# Altium project mimosa_host_fsr.PrjPcb
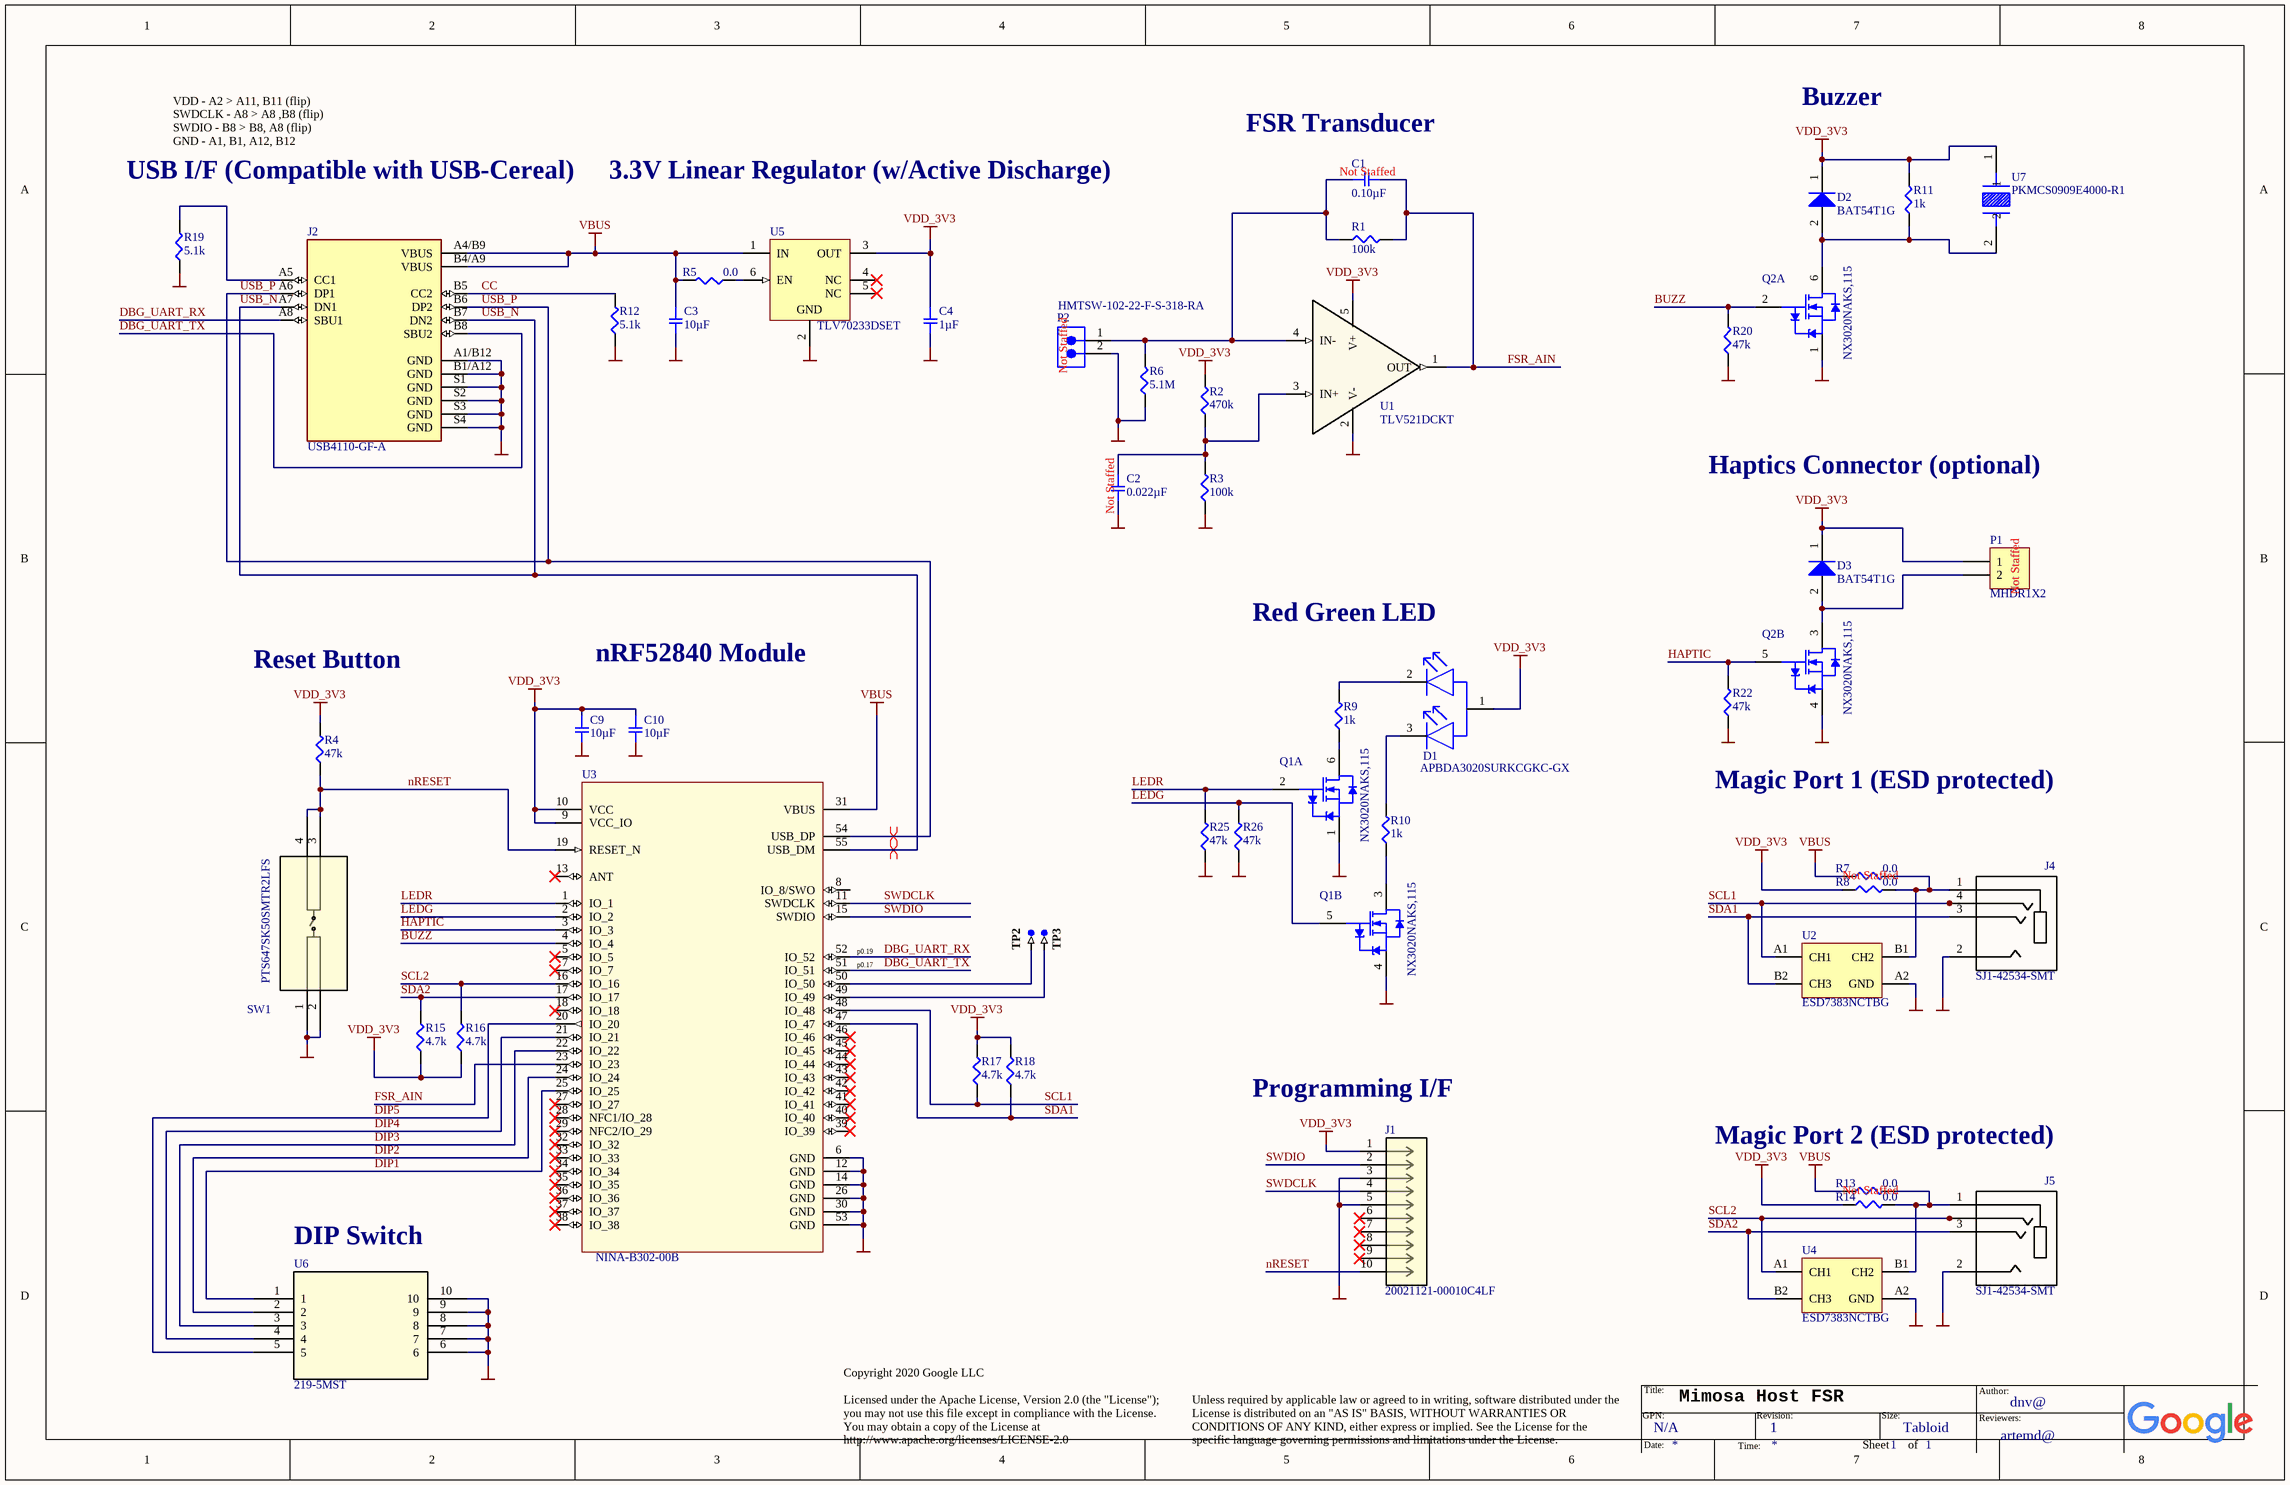
[diagram p0: mimosa_host_fsr_sch.SchDoc]
1 sheet, 50 parts. Net scope: global (net labels, ports and power ports of the same name join across sheets).
Board file: mimosa_host_fsr.PcbDoc

## Sheet mimosa_host_fsr_sch.SchDoc: Mimosa Host FSR
size Tabloid; CheckedBy: artemd@; Author: dnv@; DrawnBy: dnv; Organization: Altium Limited; Address1: 1600 Amphitheatre Pkwy, Mountain View CA 94043; DocumentNumber: N/A; Revision: 1; SheetNumber: 1; SheetTotal: 1

### Parts
C1  0.10µF  [SMD-0201C]
C2  0.022µF  [SMD-0201C]
C3  10µF  [SMD-0402C]
C4  1µF  [SMD-0201C]
C9  10µF  [SMD-0402C]
C10  10µF  [SMD-0402C]
D1  APBDA3020SURKCGKC-GX  [Kingbright_0_MFG]
D2  BAT54T1G  [ONSC-SOD-123-2-425-04_V]
D3  BAT54T1G  [ONSC-SOD-123-2-425-04_V]
J1  20021121-00010C4LF  [CONN_00010C4LF_A]
J2  USB4110-GF-A  [GCT_USB4110-GF-A]
J4  SJ1-42534-SMT  [*CUI_SJ1-42534-SMT_SJ1-42534-SMT(Primary)]
J5  SJ1-42534-SMT  [*CUI_SJ1-42534-SMT_SJ1-42534-SMT(Primary)]
P1  MHDR1X2  [MHDR1X2]
P2  HMTSW-102-22-F-S-318-RA  [SMTC-HMTSW-102-22-X-S-318-RA]
Q1  NX3020NAKS,115  [NXP-SOT363_N]  (parts A,B of 2)
Q2  NX3020NAKS,115  [NXP-SOT363_N]  (parts A,B of 2)
R1  100k  [SMD-0201-RES]
R2  470k  [SMD-0201-RES]
R3  100k  [SMD-0201-RES]
R4  47k  [SMD-0201-RES]
R5  0.0  [SMD-0201-RES]
R6  5.1M  [SMD-0201-RES]
R7  0.0  [SMD-0201-RES]
R8  0.0  [SMD-0201-RES]
R9  1k  [SMD-0201-RES]
R10  1k  [SMD-0201-RES]
R11  1k  [SMD-0201-RES]
R12  5.1k  [SMD-0201-RES]
R13  0.0  [SMD-0201-RES]
R14  0.0  [SMD-0201-RES]
R15  4.7k  [SMD-0201-RES]
R16  4.7k  [SMD-0201-RES]
R17  4.7k  [SMD-0201-RES]
R18  4.7k  [SMD-0201-RES]
R19  5.1k  [SMD-0201-RES]
R20  47k  [SMD-0201-RES]
R22  47k  [SMD-0201-RES]
R25  47k  [SMD-0201-RES]
R26  47k  [SMD-0201-RES]
SW1  PTS647SK50SMTR2LFS  [PTS647SK50SMTR2L]
TP2  TP-SM-C-100  [TP-SM-C-100]  (value not drawn)  (no BOM)
TP3  TP-SM-C-100  [TP-SM-C-100]  (value not drawn)  (no BOM)
U1  TLV521DCKT  [*SOT65P210X110-5N]
U2  ESD7383NCTBG  [ONSC-WLCSP-4-567CB-01]
U3  NINA-B302-00B  [NINA-B302-00B]
U4  ESD7383NCTBG  [ONSC-WLCSP-4-567CB-01]
U5  TLV70233DSET  [TI-DSE6_V]
U6  219-5MST  [SW5_219SMT]
U7  PKMCS0909E4000-R1  [XDCR_PKMCS0909E4000-R1]

### Nets
GND: C2.2 C3.2 C4.2 C9.2 C10.2 J1.3 J1.5 J2.A1/B12(GND) J2.B1/A12(GND) J2.S1(GND) J2.S2(GND) J2.S3(GND) J2.S4(GND) J4.2 J5.2 P2.2 Q1.1(S1) Q1.4(S2) Q2.1(S1) Q2.4(S2) R3.1 R6.1 R12.1 R19.1 R20.1 R22.1 R25.1 R26.1 SW1.1 SW1.2 U1.2(V-) U2.A2(GND) U3.6(GND) U3.12(GND) U3.14(GND) U3.26(GND) U3.30(GND) U3.53(GND) U4.A2(GND) U5.2(GND) U6.6 U6.7 U6.8 U6.9 U6.10
VBUS: C3.1 J2.A4/B9(VBUS) J2.B4/A9(VBUS) R5.2 R7.1 R13.1 U3.31(VBUS) U5.1(IN)
VDD_3V3: C4.1 C9.1 C10.1 D1.1(Common_Anode) D2.1(K) D3.1(K) J1.1 P1.1 R2.2 R4.2 R8.1 R11.2 R14.1 R15.1 R16.1 R17.2 R18.2 U1.5(V+) U3.9(VCC_IO) U3.10(VCC) U5.3(OUT) U7.1
BUZZ: Q2.2(G1) R20.2 U3.4(IO_4)
CC: J2.B5(CC2) R12.2
DBG_UART_RX: J2.A8(SBU1) U3.52(IO_52)
DBG_UART_TX: J2.B8(SBU2) U3.51(IO_51)
DIP1: U3.25(IO_25) U6.1
DIP2: U3.24(IO_24) U6.2
DIP3: U3.22(IO_22) U6.3
DIP4: U3.21(IO_21) U6.4
DIP5: U3.20(IO_20) U6.5
FSR_AIN: C1.2 R1.2 U1.1(OUT) U3.23(IO_23)
HAPTIC: Q2.5(G2) R22.2 U3.3(IO_3)
LEDG: Q1.5(G2) R26.2 U3.2(IO_2)
LEDR: Q1.2(G1) R25.2 U3.1(IO_1)
nRESET: J1.10 R4.1 SW1.3 SW1.4 U3.19(RESET_N)
SCL1: J4.4 J4.4.1 R17.1 U2.A1(CH1) U3.48(IO_48)
SCL2: J5.4 J5.4.1 R16.2 U3.16(IO_16) U4.A1(CH1)
SDA1: J4.3 R18.1 U2.B2(CH3) U3.47(IO_47)
SDA2: J5.3 R15.2 U3.17(IO_17) U4.B2(CH3)
SWDCLK: J1.4 U3.11(SWDCLK)
SWDIO: J1.2 U3.15(SWDIO)
USB_N: J2.A7(DN1) J2.B7(DN2) U3.55(USB_DM)
USB_P: J2.A6(DP1) J2.B6(DP2) U3.54(USB_DP)
NetC1_1: C1.1 P2.1 R1.1 R6.2 U1.4(IN-)
NetC2_1: C2.1 R2.1 R3.2 U1.3(IN+)
NetD1_2: D1.2(Red_C) R9.2
NetD1_3: D1.3(Green_C) R10.2
NetD2_2: D2.2(A) Q2.6(D1) R11.1 U7.2
NetD3_2: D3.2(A) P1.2 Q2.3(D2)
NetJ2_A5: J2.A5(CC1) R19.2
NetJ4_1: J4.1 R7.2 R8.2 U2.B1(CH2)
NetJ5_1: J5.1 R13.2 R14.2 U4.B1(CH2)
NetQ1_3: Q1.3(D2) R10.1
NetQ1_6: Q1.6(D1) R9.1
NetR5_1: R5.1 U5.6(EN)
NetTP2_1: TP2.1 U3.50(IO_50)
NetTP3_1: TP3.1 U3.49(IO_49)

Not connected (* = marked no-connect by the designer): J1 6* 7* 8* 9*; U3 5(IO_5)* 7(IO_7)* 8(IO_8/SWO) 13(ANT)* 18(IO_18)* 27(IO_27)* 28(NFC1/IO_28)* 29(NFC2/IO_29)* 32(IO_32)* 33(IO_33)* 34(IO_34)* 35(IO_35)* 36(IO_36)* 37(IO_37)* 38(IO_38)* 39(IO_39)* 40(IO_40)* 41(IO_41)* 42(IO_42)* 43(IO_43)* 44(IO_44)* 45(IO_45)* 46(IO_46)*; U5 4(NC)* 5(NC)*

### Layout directives
differential pair: USB_N, USB_P

### Notes on the sheet
- VDD - A2 > A11, B11 (flip)
  SWDCLK - A8 > A8 ,B8 (flip)
  SWDIO - B8 > B8, A8 (flip)
  GND - A1, B1, A12, B12
- (near C1) FSR Transducer
- Buzzer
- USB I/F (Compatible with USB-Cereal)
- 3.3V Linear Regulator (w/Active Discharge)
- (near C1) Not Staffed
- (near P2) Not Staffed
- Haptics Connector (optional)
- (near C2) Not Staffed
- Red Green LED
- (near P1) Not Staffed
- Reset Button
- nRF52840 Module
- Magic Port 1 (ESD protected)
- (near R7) Not Staffed
- (near U3) p0.19
- (near U3) p0.17
- (near J1) Programming I/F
- Magic Port 2 (ESD protected)
- (near R13) Not Staffed
- (near U6) DIP Switch
- Copyright 2020 Google LLC
  Licensed under the Apache License, Version 2.0 (the "License");
  you may not use this file except in compliance with the License.
  You may obtain a copy of the License at
  http://www.apache.org/licenses/LICENSE-2.0
- Unless required by applicable law or agreed to in writing, software distributed under the License is distributed on an "AS IS" BASIS, WITHOUT WARRANTIES OR CONDITIONS OF ANY KIND, either express or implied. See the License for the specific language governing permissions and limitations under the License.
- GPN:
- Title:
- Revision:
- Size:
- Tabloid
- Author:
- Reviewers:
- Date:
- Time:
- Sheet
- of

### Library data of the parts
C1 = GRT033C81A104KE01D: CAP CER 0.1UF 10V X6S 0201; Manufacturer: Murata Electronics North America; Factory Stock: 0; Unit Price (USD): 0.1; Minimum Quantity: 1; Tolerance: ±10%; Datasheets: http://search.murata.co.jp/Ceramy/image/img/A01X/G101/ENG/GRT033C81A104KE01-01.pdf; Image: //media.digikey.com/Renders/Murata%20Renders/GRT%20Series%200201%20(0603%20Metric).jpg; Digi-Key Part Number: 490-12232-1-ND; Part Number: GRT033C81A104KE01D; Quantity Available: 1647; @ qty: 0; Packaging: Cut Tape (CT); Series: GRT; Part Status: Active; Value: 0.10µF; Voltage: 10V; Temperature Coefficient: X6S; Operating Temperature: -55°C ~ 105°C; Features: -; Ratings: AEC-Q200; Applications: Automotive; Failure Rate: Surface Mount, MLCC; Mounting Type: 0201 (0603 Metric); Package / Case: 0.024" L x 0.012" W (0.60mm x 0.30mm); Size / Dimension: -; Height - Seated (Max): 0.013" (0.33mm); Thickness (Max): -; Lead Spacing: -
C2 = GRM033C80J223KE01D: CAP CER 0.022UF 6.3V X6S 0201; Manufacturer: Murata Electronics North America; Factory Stock: 0; Unit Price (USD): 0.1; Minimum Quantity: 1; Tolerance: ±10%; Datasheets: http://www.murata.com/~/media/webrenewal/support/library/catalog/products/capacitor/mlcc/c02e.pdf; Image: //media.digikey.com/Renders/Murata%20Renders/ZRB-SERIES-0402.jpg; Digi-Key Part Number: 490-8154-1-ND; Part Number: GRM033C80J223KE01D; Quantity Available: 18738; @ qty: 0; Packaging: Cut Tape (CT); Series: GRM; Part Status: Active; Value: 0.022µF; Voltage: 6.3V; Temperature Coefficient: X6S; Operating Temperature: -55°C ~ 105°C; Features: -; Ratings: -; Applications: General Purpose; Failure Rate: Surface Mount, MLCC; Mounting Type: 0201 (0603 Metric); Package / Case: 0.024" L x 0.012" W (0.60mm x 0.30mm); Size / Dimension: -; Height - Seated (Max): 0.013" (0.33mm); Thickness (Max): -; Lead Spacing: -
C3 C9 C10 = GRJ155R60J106ME11D: CAP CER 10UF 6.3V X5R 0402; Manufacturer: Murata Electronics North America; Factory Stock: 0; Unit Price (USD): 0.23; Minimum Quantity: 1; Tolerance: ±20%; Datasheets: http://psearch.en.murata.com/capacitor/product/GRJ155R60J106ME11%23.pdf; Image: //media.digikey.com/Renders/Murata%20Renders/ZRB-SERIES-0402.jpg; Digi-Key Part Number: 490-13211-1-ND; Quantity Available: 64064; @ qty: 0; Packaging: Cut Tape (CT); Series: GRJ; Part Status: Active; Value: 10µF; Voltage: 6.3V; Temperature Coefficient: X5R; Operating Temperature: -55°C ~ 85°C; Features: Derating Recommended, Soft Termination; Ratings: -; Applications: Boardflex Sensitive; Mounting Type: Surface Mount, MLCC; Package / Case: 0402 (1005 Metric); Size / Dimension: 0.039" L x 0.020" W (1.00mm x 0.50mm); Height - Seated (Max): -; Thickness (Max): 0.028" (0.70mm); Lead Spacing: -; Lead Style: -
  C3: MPN: GRJ155R60J106ME11D
  C9 C10: Part Number: GRJ155R60J106ME11D
C4 = GRM033R60J105MEA2D: CAP CER 1UF 6.3V X5R 0201; Manufacturer: Murata Electronics North America; Factory Stock: 0; Unit Price (USD): 0.12; Minimum Quantity: 1; Tolerance: ±20%; Datasheets: http://www.murata.com/~/media/webrenewal/support/library/catalog/products/capacitor/mlcc/c02e.pdf; Image: //media.digikey.com/Renders/Murata%20Renders/ZRB-SERIES-0402.jpg; Digi-Key Part Number: 490-7229-1-ND; Part Number: GRM033R60J105MEA2D; Quantity Available: 223818; @ qty: 0; Packaging: Cut Tape (CT); Series: GRM; Part Status: Active; Value: 1µF; Voltage: 6.3V; Temperature Coefficient: X5R; Operating Temperature: -55°C ~ 85°C; Features: Derating Recommended; Ratings: -; Applications: General Purpose; Failure Rate: Surface Mount, MLCC; Mounting Type: 0201 (0603 Metric); Package / Case: 0.024" L x 0.012" W (0.60mm x 0.30mm); Size / Dimension: -; Height - Seated (Max): 0.013" (0.33mm); Thickness (Max): -; Lead Spacing: -
D2 D3 = BAT54T1G: Schottky Barrier Diode, 2-Pin SOD-123, Pb-Free, Tape and Reel; Manufacturer: On Semiconductor; Configuration: Single; IFSM Max (A): 0.6; trr Max (ns): 5; DatasheetVersion: Rev. 9; PackageVersion: Rev. G, 10/2009; PackageReference: SOD-123-2-425-04; PackageDescription: 2-Pin SOD, Body 1.6 x 2.69 mm; Supplier 1: Digi-Key; Supplier Part Number 1: BAT54T1GOSTR-ND; Supplier 2: Digi-Key; Supplier Part Number 2: BAT54T1GOSCT-ND; Supplier 3: Digi-Key; Supplier Part Number 3: BAT54T1GOSDKR-ND; Supplier 4: Farnell; Supplier Part Number 4: 1651157RL; Supplier 5: Farnell; Supplier Part Number 5: 1651157; Supplier 6: Farnell; Supplier Part Number 6: 2364774; Supplier 7: Newark; Supplier Part Number 7: 67R1284; Supplier 8: Newark; Supplier Part Number 8: 88H4554; Supplier 9: Mouser; Supplier Part Number 9: 863-BAT54T1G; Packing: Tape and Reel; RoHS: TRUE; Mounting Technology: Surface Mount; Part Number: BAT54T1G; ComponentLink1Description: Manufacturer URL; ComponentLink1URL: http://www.onsemi.com/; ComponentLink2Description: Datasheet; ComponentLink2URL: http://www.onsemi.cn/pub_link/Collateral/BAT54T1-D.PDF; ComponentLink3Description: Package Specification; ComponentLink3URL: http://www.onsemi.com/pub_link/Collateral/425-04.PDF
J1 = 20021121-00010C4: No Description Available; Built_By: EMA_Matt; Vendor: Amphenol; SourceLibrary: Amphenol_2019-10-30; Copyright: Copyright (C) 2018 Accelerated Designs. All rights reserved; Manufacturer_Part_Number: 20021121-00010C4LF; RefDes: RefDes; Type: DEV
J2 = USB4110-GF-A: USB-C _USB TYPE-C_ USB 2.0 Receptacle Connector 24 _16+8 Dummy_ Position Surface Mount, Right Angle; Through Hole; MF: GCT; Digi-Key_Purchase_URL: https://www.digikey.com/product-detail/en/gct/USB4110-GF-A/2073-USB4110-GF-A-1-ND/10384548?utm_source=snapeda&utm_medium=aggregator&utm_campaign=symbol; Value: *; Package: None; MP: USB4110-GF-A; SnapEDA_Link: https://www.snapeda.com/parts/USB4110-GF-A/Global%20Connector%20Technology/view-part/4001167/?ref=snap; Digi-Key_Part_Number: 2073-USB4110-GF-A-1-ND
J4 J5 = SJ1-42534-SMT: 2.5 mm, 4 Conductors, Right Angle, Surface Mount _SMT_, Audio Jack Connector; Manufacturer: CUI Devices; Part Number: SJ1-42534-SMT-TR; SnapEDA_Link: https://www.snapeda.com/parts/SJ1-42534-SMT-TR/CUI%20Devices/view-part/?ref=snap; Digi-Key_Part_Number: CP1-42534SJCT-ND; Digi-Key_Purchase_URL: https://www.digikey.com/product-detail/en/cui-devices/SJ1-42534-SMT-TR/CP1-42534SJCT-ND/659931?utm_source=snapeda&utm_medium=aggregator&utm_campaign=symbol; CUI_purchase_URL: https://www.cuidevices.com/product/interconnect/connectors/audio-connectors/jacks/sj1-4253x-smt-series?utm_source=snapeda.com&utm_medium=referral&utm_campaign=snapedaBOM; Package: None; Value: *
P1 = MHDR1X2: Header, 2-Pin; LatestRevisionDate: 17-Jul-2002; LatestRevisionNote: Re-released for DXP Platform.; Publisher: Altium Limited
P2 = HMTSW-102-22-F-S-318-RA: Modified .025" SQ Post Header, Through-hole, Right Angle, -55 to 125 degC, 2.54 mm Pitch, 2-Pin, Male, RoHS; Manufacturer: Samtec; Pitch: 2.54 mm; DatasheetVersion: F-214; PackageVersion: AL, 3/1987; PackageReference: HMTSW-102-22-X-S-318-RA; PackageDescription: Assembly .025 [.64] SQ. Post Hi-Temp Terminal Strip; Orientation: Right Angle; RoHS: True; Temperature Range: -55 to 125 degC; Mounting Technology: Through-hole; PartNumber: HMTSW-102-22-F-S-318-RA; ComponentLink1Description: Manufacturer URL; ComponentLink1URL: http://www.samtec.com; ComponentLink2Description: Datasheet; ComponentLink2URL: http://www.samtec.com/documents/webfiles/pdf/HMTSW.PDF; ComponentLink3Description: Package Specification; ComponentLink3URL: http://www.samtec.com/documents/webfiles/cpdf/HMTSW-XXX-XX-X-X-XXXX-XX-XX-MKT1.pdf
Q1 Q2 = NX3020NAKS,115: Dual N-Channel Trench MOSFET, 30 V, 0.18 A, -55 to 150 degC, 6-Pin SOT363, Tape and Reel; Manufacturer: NXP Semiconductors; Channel Type: N; Ciss [typ] (pF): 13; Coss [typ] (pF): 2.6; ID [max] (A): 0.18; Packing: Tape & Reel; VDS [max] (V): 30; VGSth [typ] (V): 1.2; DatasheetVersion: Rev. 3; PackageVersion: 06-03-16, 03/2006; PackageReference: SOT363; PackageDescription: 6-Pin Small Outline Transistor Package, Body 2 x 1.25 mm, Pitch 0.65 mm; Supplier 1: Digi-Key; Supplier Part Number 1: 568-10505-2-ND; Supplier 2: Digi-Key; Supplier Part Number 2: 568-10505-1-ND; Supplier 3: Digi-Key; Supplier Part Number 3: 568-10505-6-ND; Supplier 4: Mouser; Supplier Part Number 4: 771-NX3020NAKS115; Mounting Technology: Surface Mount; Code_JEITA: SC-88; Part Number: NX3020NAKS,115; ComponentLink1Description: Manufacturer URL; ComponentLink1URL: http://www.nxp.com/; ComponentLink2Description: Datasheet; ComponentLink2URL: http://www.nxp.com/documents/data_sheet/NX3020NAKS.pdf; ComponentLink3Description: Package Specification; ComponentLink3URL: http://www.nxp.com/documents/outline_drawing/sot363_po.pdf
R1 R3 = ERJ-1GEF1003C: RES SMD 100K OHM 1% 1/20W 0201; Manufacturer: Panasonic Electronic Components; Factory Stock: 0; Unit Price (USD): 0.00933; @ qty: 1500; Minimum Quantity: 1; Power (Watts): 0.05W, 1/20W; Temperature Coefficient: ±200ppm/°C; Part Number: ERJ-1GEF1003C; Datasheets: //media.digikey.com/pdf/Data%20Sheets/Panasonic%20Resistors%20Thermistors%20PDFs/ERJ_G,R,E_Rev08.pdf; Image: //media.digikey.com/Renders/Panasonic%20Renders/ERJ-0201%20Pkg.jpg; Digi-Key Part Number: P100KABCT-ND; Quantity Available: 3284120; Packaging: Cut Tape (CT); Series: ERJ; Part Status: Active; Value: 100k; Tolerance: ±1%; Composition: Thick Film; Features: -; Operating Temperature: -55°C ~ 125°C; Package / Case: 0201 (0603 Metric); Supplier Device Package: 0201; Size / Dimension: 0.024" L x 0.012" W (0.60mm x 0.30mm); Height - Seated (Max): 0.010" (0.26mm); Number of Terminations: 2; Failure Rate: -
R2 = ERJ-1GEF4703C: RES SMD 470K OHM 1% 1/20W 0201; Manufacturer: Panasonic Electronic Components; Factory Stock: 0; Unit Price (USD): 0.00933; @ qty: 1500; Minimum Quantity: 1; Power (Watts): 0.05W, 1/20W; Temperature Coefficient: ±200ppm/°C; Part Number: ERJ-1GEF4703C; Datasheets: //media.digikey.com/pdf/Data%20Sheets/Panasonic%20Resistors%20Thermistors%20PDFs/ERJ_G,R,E_Rev08.pdf; Image: //media.digikey.com/Renders/Panasonic%20Renders/ERJ-0201%20Pkg.jpg; Digi-Key Part Number: P470KABCT-ND; Quantity Available: 12534; Packaging: Cut Tape (CT); Series: ERJ; Part Status: Active; Value: 470k; Tolerance: ±1%; Composition: Thick Film; Features: -; Operating Temperature: -55°C ~ 125°C; Package / Case: 0201 (0603 Metric); Supplier Device Package: 0201; Size / Dimension: 0.024" L x 0.012" W (0.60mm x 0.30mm); Height - Seated (Max): 0.010" (0.26mm); Number of Terminations: 2; Failure Rate: -
R4 R20 R22 R25 R26 = ERJ-1GEF4702C: RES SMD 47K OHM 1% 1/20W 0201; Manufacturer: Panasonic Electronic Components; Factory Stock: 0; Unit Price (USD): 0.00933; @ qty: 1500; Minimum Quantity: 1; Power (Watts): 0.05W, 1/20W; Temperature Coefficient: ±200ppm/°C; Part Number: ERJ-1GEF4702C; Datasheets: //media.digikey.com/pdf/Data%20Sheets/Panasonic%20Resistors%20Thermistors%20PDFs/ERJ_G,R,E_Rev08.pdf; Image: //media.digikey.com/Renders/Panasonic%20Renders/ERJ-0201%20Pkg.jpg; Digi-Key Part Number: P47.0KABCT-ND; Quantity Available: 276878; Packaging: Cut Tape (CT); Series: ERJ; Part Status: Active; Value: 47k; Tolerance: ±1%; Composition: Thick Film; Features: -; Operating Temperature: -55°C ~ 125°C; Package / Case: 0201 (0603 Metric); Supplier Device Package: 0201; Size / Dimension: 0.024" L x 0.012" W (0.60mm x 0.30mm); Height - Seated (Max): 0.010" (0.26mm); Number of Terminations: 2; Failure Rate: -
R5 R7 R8 R13 R14 = ERJ-1GE0R00C: RES SMD 0.0OHM JUMPER 1/20W 0201; Manufacturer: Panasonic Electronic Components; Factory Stock: 0; Unit Price (USD): 0.00960; @ qty: 1500; Minimum Quantity: 1; Power (Watts): 0.05W, 1/20W; Part Number: ERJ-1GE0R00C; Datasheets: //media.digikey.com/pdf/Data%20Sheets/Panasonic%20Resistors%20Thermistors%20PDFs/ERJ_G_Rev06.pdf; Image: //media.digikey.com/Renders/Panasonic%20Renders/ERJ-0201%20Pkg.jpg; Digi-Key Part Number: P0.0AGCT-ND; Quantity Available: 2883022; Packaging: Cut Tape (CT); Series: ERJ; Part Status: Active; Value: 0.0; Tolerance: Jumper; Composition: Thick Film; Features: -; Temperature Coefficient: -; Operating Temperature: -55°C ~ 125°C; Package / Case: 0201 (0603 Metric); Supplier Device Package: 0201; Size / Dimension: 0.024" L x 0.012" W (0.60mm x 0.30mm); Height - Seated (Max): 0.010" (0.26mm); Number of Terminations: 2; Failure Rate: -
R6 = ERJ-1GEJ515C: RES SMD 5.1M OHM 5% 1/20W 0201; Manufacturer: Panasonic Electronic Components; Factory Stock: 0; Unit Price (USD): 0.00787; @ qty: 1500; Minimum Quantity: 1; Power (Watts): 0.05W, 1/20W; Temperature Coefficient: -400/ +150ppm/°C; Part Number: ERJ-1GEJ515C; Datasheets: //media.digikey.com/pdf/Data%20Sheets/Panasonic%20Resistors%20Thermistors%20PDFs/ERJ%205%25.pdf; Image: //media.digikey.com/Renders/Panasonic%20Renders/ERJ-0201%20Pkg.jpg; Digi-Key Part Number: P5.1MAGCT-ND; Quantity Available: 316490; Packaging: Cut Tape (CT); Series: ERJ; Part Status: Active; Value: 5.1M; Tolerance: ±5%; Composition: Thick Film; Features: -; Operating Temperature: -55°C ~ 125°C; Package / Case: 0201 (0603 Metric); Supplier Device Package: 0201; Size / Dimension: 0.024" L x 0.012" W (0.60mm x 0.30mm); Height - Seated (Max): 0.010" (0.26mm); Number of Terminations: 2; Failure Rate: -
R9-R11 = ERJ-1GEF1001C: RES SMD 1K OHM 1% 1/20W 0201; Manufacturer: Panasonic Electronic Components; Factory Stock: 0; Unit Price (USD): 0.00933; @ qty: 1500; Minimum Quantity: 1; Power (Watts): 0.05W, 1/20W; Temperature Coefficient: ±200ppm/°C; Part Number: ERJ-1GEF1001C; Datasheets: //media.digikey.com/pdf/Data%20Sheets/Panasonic%20Resistors%20Thermistors%20PDFs/ERJ_G,R,E_Rev08.pdf; Image: //media.digikey.com/Renders/Panasonic%20Renders/ERJ-0201%20Pkg.jpg; Digi-Key Part Number: P1.00KABCT-ND; Quantity Available: 359548; Packaging: Cut Tape (CT); Series: ERJ; Part Status: Active; Value: 1k; Tolerance: ±1%; Composition: Thick Film; Features: -; Operating Temperature: -55°C ~ 125°C; Package / Case: 0201 (0603 Metric); Supplier Device Package: 0201; Size / Dimension: 0.024" L x 0.012" W (0.60mm x 0.30mm); Height - Seated (Max): 0.010" (0.26mm); Number of Terminations: 2; Failure Rate: -
R12 R19 = ERJ-1GEF5101C: RES SMD 5.1K OHM 1% 1/20W 0201; Manufacturer: Panasonic Electronic Components; Factory Stock: 0; Unit Price (USD): 0.00933; @ qty: 1500; Minimum Quantity: 1; Power (Watts): 0.05W, 1/20W; Temperature Coefficient: ±200ppm/°C; Part Number: ERJ-1GEF5101C; Datasheets: //media.digikey.com/pdf/Data%20Sheets/Panasonic%20Resistors%20Thermistors%20PDFs/ERJ_G,R,E_Rev08.pdf; Image: //media.digikey.com/Renders/Panasonic%20Renders/ERJ-0201%20Pkg.jpg; Digi-Key Part Number: P5.10KABCT-ND; Quantity Available: 106914; Packaging: Cut Tape (CT); Series: ERJ; Part Status: Active; Value: 5.1k; Tolerance: ±1%; Composition: Thick Film; Features: -; Operating Temperature: -55°C ~ 125°C; Package / Case: 0201 (0603 Metric); Supplier Device Package: 0201; Size / Dimension: 0.024" L x 0.012" W (0.60mm x 0.30mm); Height - Seated (Max): 0.010" (0.26mm); Number of Terminations: 2; Failure Rate: -
R15-R18 = ERJ-1GEF4701C: RES SMD 4.7K OHM 1% 1/20W 0201; Manufacturer: Panasonic Electronic Components; Factory Stock: 0; Unit Price (USD): 0.00933; @ qty: 1500; Minimum Quantity: 1; Power (Watts): 0.05W, 1/20W; Temperature Coefficient: ±200ppm/°C; Part Number: ERJ-1GEF4701C; Datasheets: //media.digikey.com/pdf/Data%20Sheets/Panasonic%20Resistors%20Thermistors%20PDFs/ERJ_G,R,E_Rev08.pdf; Image: //media.digikey.com/Renders/Panasonic%20Renders/ERJ-0201%20Pkg.jpg; Digi-Key Part Number: P4.70KABCT-ND; Quantity Available: 760979; Packaging: Cut Tape (CT); Series: ERJ; Part Status: Active; Value: 4.7k; Tolerance: ±1%; Composition: Thick Film; Features: -; Operating Temperature: -55°C ~ 125°C; Package / Case: 0201 (0603 Metric); Supplier Device Package: 0201; Size / Dimension: 0.024" L x 0.012" W (0.60mm x 0.30mm); Height - Seated (Max): 0.010" (0.26mm); Number of Terminations: 2; Failure Rate: -
SW1 = PTS647SK50SMTR2L: No Description Available; Vendor: C&K; Built_By: EMA_Cory; SourceLibrary: C&K_2020-03-19; Datasheet: https://dznh3ojzb2azq.cloudfront.net/products/Tactile/PTS647/documents/datasheet.pdf; Manufacturer_Part_Number: PTS647SK50SMTR2LFS; Copyright: Copyright (C) 2018 Accelerated Designs. All rights reserved; RefDes: RefDes; Type: DEV
TP2 TP3 = CMP-0484-00002-2: Test Point, Surface Mount, Circular, Pad Diameter 1 mm; Manufacturer: No Vendor; PartNumber: TP-SM-C-100
U2 U4 = ESD7383NCTBG: USB-OTG 3-Line Protection, 4-Pin WLCSP, Pb-Free, Tape and Reel; Manufacturer: On Semiconductor; C Max (pF): 1.5; Direction: Bidirectional; IR Max (uA): 0.1; Number of Lines: 3; PPK Max (W): 50; V(BR) Min (V): 6; DatasheetVersion: Rev. 0; PackageVersion: Rev. O, 07/2010; PackageReference: WLCSP-4-567CB-01; PackageDescription: 4-Ball Wafer Level Chip Scale Package, Body 0.8 x 0.8 mm, Pitch 0.4 mm; Supplier 1: Digi-Key; Supplier Part Number 1: ESD7383NCTBG-ND; Supplier 2: Mouser; Supplier Part Number 2: 863-ESD7383NCTBG; Packing: Tape and Reel; RoHS: Pb-Free; Mounting Technology: Surface Mount; PartNumber: ESD7383NCTBG; ComponentLink1Description: Manufacturer URL; ComponentLink1URL: http://www.onsemi.com/; ComponentLink2Description: Datasheet; ComponentLink2URL: http://www.onsemi.cn/pub_link/Collateral/ESD7383-D.PDF; ComponentLink3Description: Package Specification; ComponentLink3URL: http://www.onsemi.cn/pub_link/Collateral/567CB.PDF
U3 = NINA-B311-00B: Bluetooth Bluetooth v5.0 Transceiver Module 2.4GHz Antenna Not Included Surface Mount; Manufacturer: U-Blox America Inc.; Price: None; Part Number: NINA-B302-00B; Package: SMD-55 U-Blox America Inc.; SnapEDA_Link: https://www.snapeda.com/parts/NINA-B311-00B/U-Blox%20America%20Inc./view-part/3219108/?ref=snap; Availability: Unavailable; Value: *
U5 = TLV70233DSET: Single Output LDO, 300 mA, Fixed 3.3 V Output, 2 to 5.5 V Input, with Low IQ, 6-pin WSON (DSE), -40 to 125 degC, Green (RoHS & no Sb/Br); Manufacturer: Texas Instruments; Accuracy(%): 2; Fixed Output Options(V): 3.3; Iout(Max)(A): 0.3; Iq(Typ)(mA): 0.03; SubFamily: Single Channel LDO; Vdo(Typ)(mV): 220; Vin(Max)(V): 5.5; DatasheetVersion: SLVSAG6B; PackageVersion: 4207810/A; PackageReference: DSE6; PackageDescription: 6-Pin Plastic Small Outline, Body 1.5 x 1.5 mm, Pitch 0.5 mm; Supplier 1: Digi-Key; Supplier Part Number 1: 296-32416-2-ND; Supplier 2: Digi-Key; Supplier Part Number 2: 296-32416-1-ND; Supplier 3: Digi-Key; Supplier Part Number 3: 296-32416-6-ND; Supplier 4: Newark; Supplier Part Number 4: 87T3942; Supplier 5: Mouser; Supplier Part Number 5: 595-TLV70233DSET; Eco-Plan: Green (RoHS & no Sb/Br); Vin(Min)(V): 2; Vout Adj(Max)(V): 3.3; Vout Adj(Min)(V): 3.3; Mounting Technology: Surface Mount; Part Number: TLV70233DSET; ComponentLink1Description: Manufacturer URL; ComponentLink1URL: http://www.ti.com/; ComponentLink2Description: Datasheet; ComponentLink2URL: http://www.ti.com/general/docs/lit/getliterature.tsp?genericPartNumber=TLV70233&fileType=pdf; ComponentLink3Description: Package Specification; ComponentLink3URL: http://www.ti.com/litv/pdf/mpds287
U6 = 219-5MST: No Description Available; Built_By: EMA_Justin; Vendor: CTS Components; SourceLibrary: CTS_Components_2018-12-15; Copyright: Copyright (C) 2016 Accelerated Designs. All rights reserved; Manufacturer_Part_Number: 219-5MST; RefDes: RefDes; Type: DEV
U7 = PKMCS0909E4000-R1: Buzzers Transducer, Externally Driven Piezo 1.5V 4kHz 65dB @ 1.5V, 10cm Surface Mount Solder Pads; MF: Murata; Package: 2010 Murata; Digi-Key_Part_Number: 490-9647-1-ND; SnapEDA_Link: https://www.snapeda.com/parts/PKMCS0909E4000-R1/Murata%20Electronics%20North%20America/view-part/277291/?ref=snap; Digi-Key_Purchase_URL: https://www.digikey.com/product-detail/en/murata-electronics/PKMCS0909E4000-R1/490-9647-1-ND/4878401?utm_source=snapeda&utm_medium=aggregator&utm_campaign=symbol; Value: *; MP: PKMCS0909E4000-R1
U1 = TLV521DCKT: SnapEDA_Link: https://www.snapeda.com/parts/TLV521DCKT/Texas%20Instruments/view-part/809196/?ref=snap; Value: *

## Assembly variants
Populated: not fitted C1 C2 P1 P2 R7 R13